# EAGLE design Enclosure 85x58 PBC-AW (EAGLE 9.6.1)
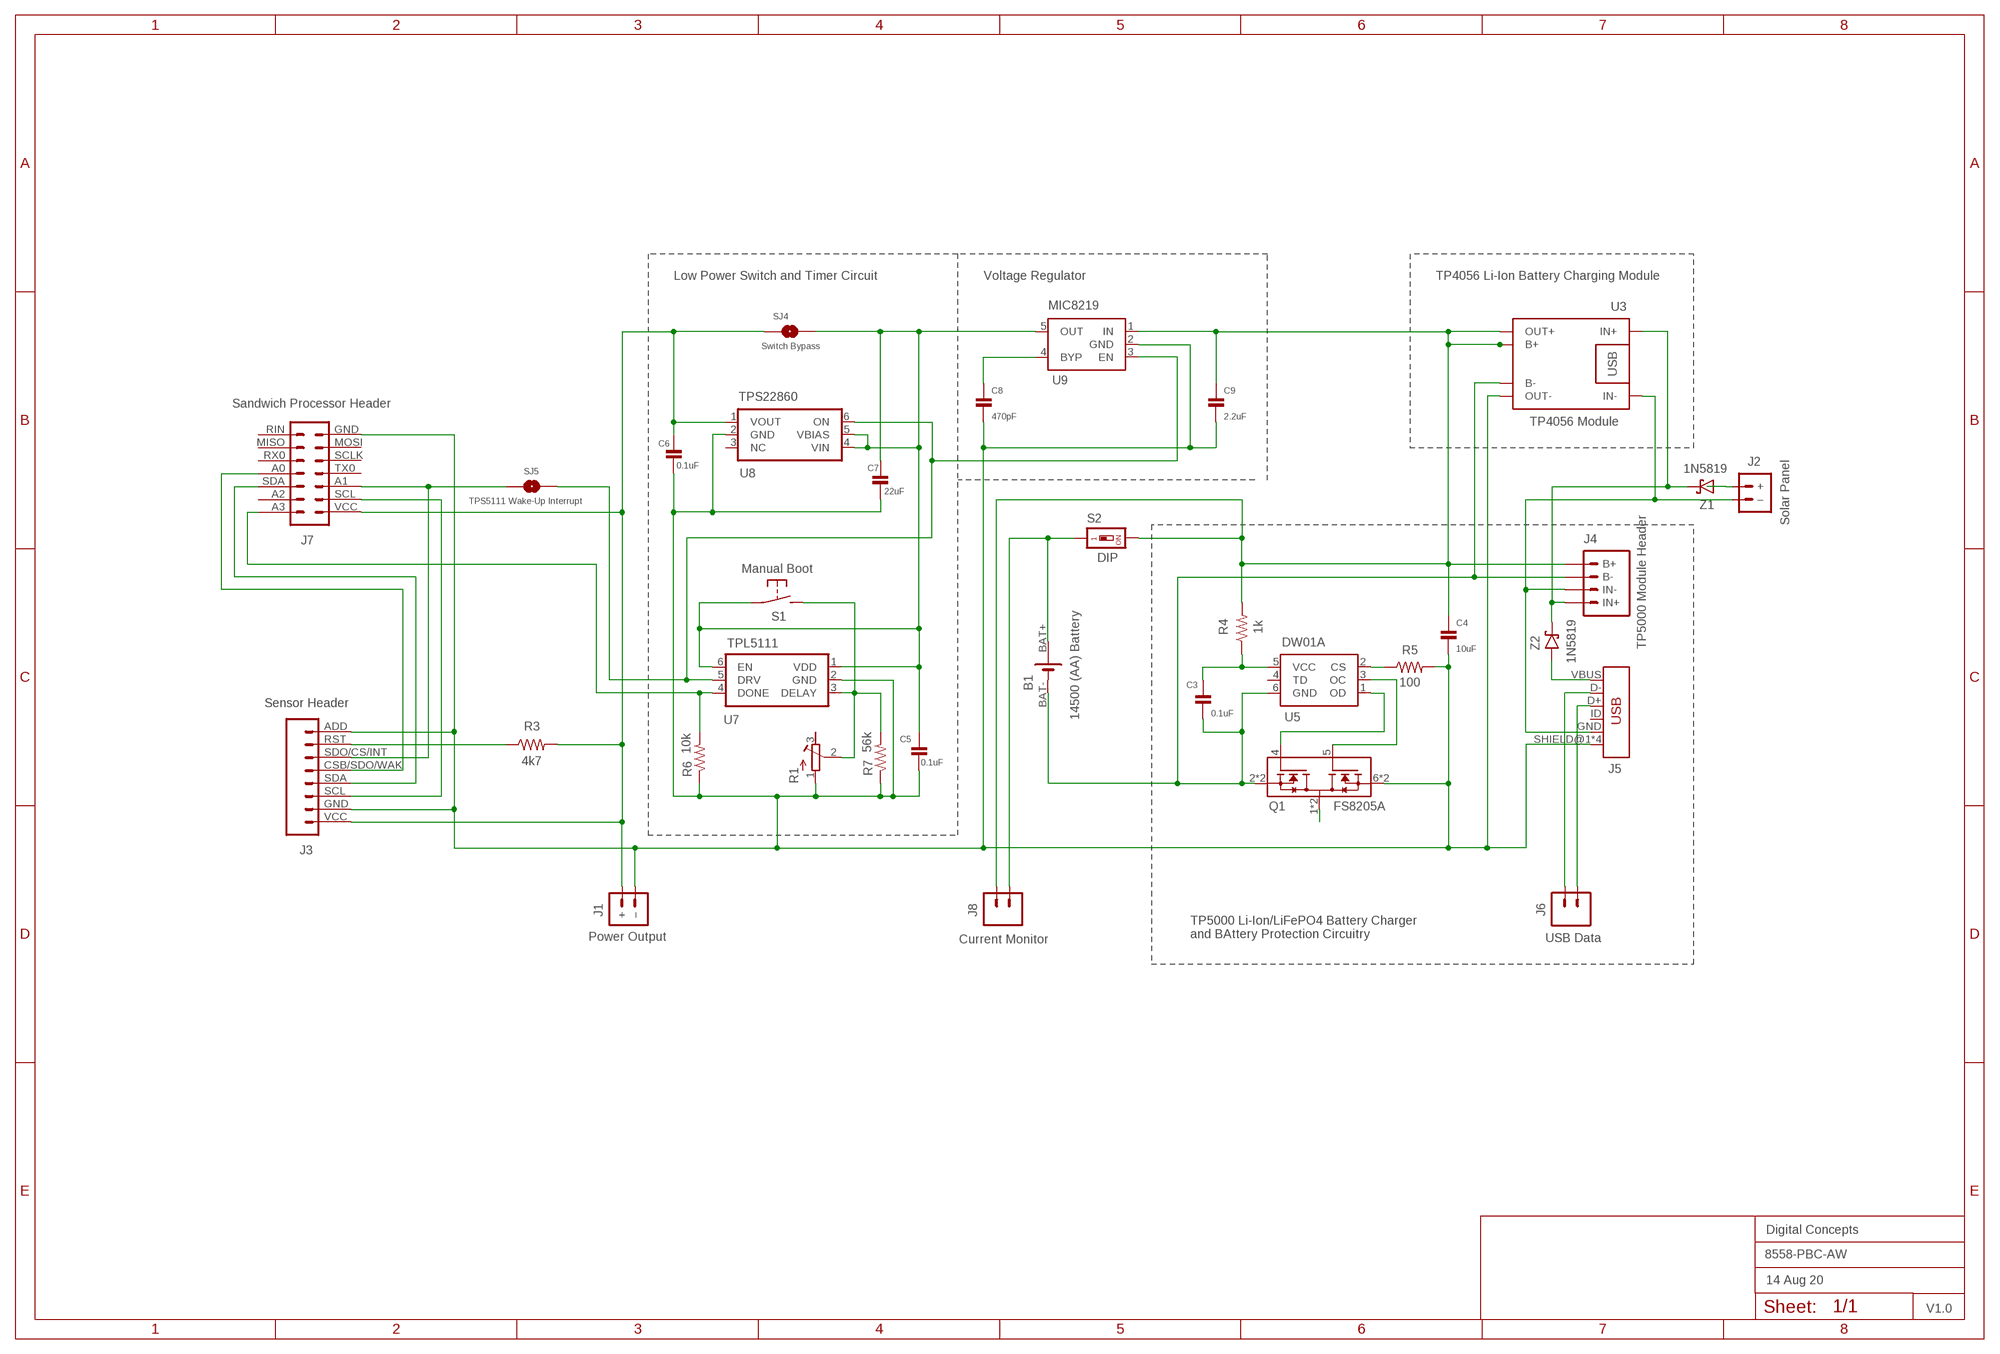
[diagram p0: schematic, sheet 1]
FRAME2 (A3L-LOC): DATE: 14 Aug 20; OWNER: Digital Concepts; TITLE: 8558-PBC-AW; VERSION: V1.0

## Parts
B1  14500 (AA) Battery  BATTERY-HOLDER-14500(AA)  [BATTERY-14500]
C3  0.1uF  CAPACITOR  [C0805]
C4  10uF  CAPACITOR  [C0805]
C5  0.1uF  CAPACITOR  [C0805]
C6  0.1uF  CAPACITOR  [C0805]
C7  22uF  CAPACITOR  [C0805]
C8  470pF  CAPACITOR  [C0805]
C9  2.2uF  CAPACITOR  [C0805]
J1  Power Output  JST-PH1.25-MALE  [JST-PH1.25]
J2  Solar Panel  JST-PH2.0-MALE  [JST-PH2.0]
J3  Sensor Header  HEADER-1X8-SENSOR  [CONN_08-SENSOR]
J4  TP5000 Module Header  TP5000-MODULE  [CONN_04-GENERIC]
J5  USB  USB_MINI-B_SMT  [USB-MINIB]
J6  USB Data  1X2-PIN-HEADER  [CONN_02-GENERIC]
J7  Sandwich Processor Header  HEADER-2X7-SANDWICH-PROCESSOR  [CONN_2X7-WIJNAND-PROCESSOR]
J8  JST-PH2.0-MALE-HORIZONTALJST-PTH-2  [JST-2-PTH]
Q1  FS8205A  [SOP65P640X120-8N]
R1  RESISTOR-TRIMM64W  [RTRIM64W]
R3  4k7  RESISTORR0805  [R0805]
R4  1k  RESISTORR0805  [R0805]
R5  100  RESISTORR0805  [R0805]
R6  10k  RESISTORR0805  [R0805]
R7  56k  RESISTORR0805  [R0805]
S1  Manual Boot  MOMENTARY-SWITCH-2-PIN  [SWITCH-2-PAD]
S2  DIP  SWITCH-DIP-SWS001  [SMS-001]
SJ4  Switch Bypass  SJ  [SJ]
SJ5  TPS5111 Wake-Up Interrupt  SJ  [SJ]
U3  TP4056 Module  BATTERY-CHARGER-LI-PROT  [BATTERY-CHARGER-LI-PROT]
U5  DW01A  [SOT23-6]
U7  TPL5111  TPL5111DDCR  [SOT-23-6]
U8  TPS22860  [SOT-23-6]
U9  MIC8219  MIC5219XX  [SOT-23-5]
Z1  1N5819  1N5819-SOD-123  [SOD-123]
Z2  1N5819  1N5819-SOD-123  [SOD-123]

## Nets
GND: C4.2 C5.2 C6.2 C7.2 C8.2 C9.2 J1.-(–) J3.ADD J3.GND J5.SHIELD@1(SHIELD) J5.SHIELD@2(SHIELD) J5.SHIELD@3(SHIELD) J5.SHIELD@4(SHIELD) J7.GND Q1.6(S2) Q1.7(S2) R1.1(A) R5.2 R6.1 R7.1 U3.OUT- U7.2(GND) U8.2(GND) U9.2(GND)
N$1: J2.+ Z1.A
N$2: J2.-(–) J4.2(IN-) J5.GND U3.IN-
N$3: R5.1 U5.2(CS)
N$4: Q1.1(D12) Q1.8(D12)
N$5: J4.1(IN+) U3.IN+ Z1.C Z2.C
N$6: C4.1 C9.1 J4.4(B+) J8.1 R4.2 S2.2 U3.B+ U3.OUT+ U9.1(IN)
N$7: C8.1 U9.4(BYP)
N$8: J3.SCL J7.SCL
N$9: J3.RST R3.1
N$10: J3.CSB/SDO/WAK J7.A0
N$11: J3.SDA J7.SDA
N$12: B1.BAT+ J8.2 S2.1
N$18: Q1.5(G2) U5.3(OC)
N$19: J5.VBUS Z2.A
N$20: Q1.4(G1) U5.1(OD)
N$21: J5.D+ J6.2
N$22: C3.1 R4.1 U5.5(VCC)
N$23: B1.BAT- C3.2 J4.3(B-) Q1.2(S1) Q1.3(S1) U3.B- U5.6(GND)
N$24: J5.D- J6.1
N$25: R1.2(S) R7.2 S1.P$2(S) U7.3(DELAY)
N$26: C5.1 C7.1 S1.P$1(P) SJ4.2 U7.1(VDD) U7.6(EN) U8.4(VIN) U8.5(VBIAS) U9.5(OUT)
N$28: SJ5.2 U7.5(DRV) U8.6(ON) U9.3(EN)
N$29: J7.A3 R6.2 U7.4(DONE)
N$30: J3.SDO/CS/INT J7.A1 SJ5.1
VCC: C6.1 J1.+ J3.VCC J7.VCC R3.2 SJ4.1 U8.1(VOUT)
Unconnected: J5.ID J7.A2 J7.MISO J7.MOSI J7.RIN J7.RX0 J7.SCLK J7.TX0 R1.3(E) U5.4(TD) U8.3(NC)

## Notes on the sheet
- Low Power Switch and Timer Circuit | Voltage Regulator | TP4056 Li-Ion Battery Charging Module
- TP5000 Li-Ion/LiFePO4 Battery Charger
  and BAttery Protection Circuitry
- Current Monitor

## Library data of the parts
B1 = digitalconcepts:BATTERY-HOLDER-14500(AA): 14500 (AA) battery holder
C3-C9 = digitalconcepts:CAPACITOR: 0805 Capacitor
J1 = digitalconcepts:JST-PH1.25-MALE: PH1.25 Male PCB Connector
J2 = digitalconcepts:JST-PH2.0-MALE: PH2.0 Male PCB Connector
J3 = digitalconcepts:HEADER-1X8-SENSOR: IoT Sensors 1x8 Pin Header for 'Sandwich' IoT Sensors
J4 = digitalconcepts:TP5000-MODULE: TP5000 Module Pin Header
J5 = digitalconcepts:USB_MINI-B: USB Mini-B Connector Breaks out 5 pins, and includes shield pins if needed.
J6 = digitalconcepts:1X2-PIN-HEADER: Single Row 2-Pin Header
J7 = digitalconcepts:HEADER-2X7-SANDWICH-PROCESSOR: 'Sandwixh' Processor 2x7 Pin Header for 'Sandwich' Processor/RFM95W PCBs
J8 = digitalconcepts:JST-PH2.0-MALE-HORIZONTAL: Multi connection point. Often used as Generic Header-pin footprint for 0.1 inch spaced/style header connections On any of the 0.1 inch spaced packages, you can populate with these: Break Away Headers - Straight <https://www.sparkfun.com/products/116> (PRT-00116) Break Away Male Headers - Right Angle <https://www.sparkfun.com/products/553> (PRT-00553) Female Headers <https://www.sparkfun.com/products/115> (PRT-00115) Break Away Headers - Machine Pin <https://www.sparkfun.com/products/117> (PRT-00117) Break Away Female Headers - Swiss Machine Pin <https://www.sparkfun.com/products/743> (PRT-00743) For SCREWTERMINALS and SPRING TERMINALS visit here: Screw Terimnals on SparkFun.com <https://www.sparkfun.com/search/results?term=Screw+Terminals> (5mm/3.5mm/2.54mm spacing) This device is also useful as a general connection point to wire up your design to another part of your project. Our various solder wires solder well into these plated through hole pads. Hook-Up Wire - Assortment (Stranded, 22 AWG) <https://www.sparkfun.com/products/11375> (PRT-11375) Hook-Up Wire - Assortment (Solid Core, 22 AWG) <https://www.sparkfun.com/products/11367> (PRT-11367) View the entire wire category on our website here <https://www.sparkfun.com/categories/141> Special notes: Molex polarized connector foot print use with: PRT-08233 with associated crimp pins and housings. 2.54_SCREWTERM for use with PRT-10571. 3.5mm Screw Terminal footprints for PRT-08084 5mm Screw Terminal footprints for use with PRT-08432; PROD_ID: CONN-09863; SKU: PRT-09914
Q1 = FS8205A:FS8205A: N/A; AVAILABILITY: Unavailable; MF: Fortune Semiconductor; MP: FS8205A; PACKAGE: Package; PRICE: None
R1 = digitalconcepts:RESISTOR-TRIMM: Trimm resistor
R3-R7 = digitalconcepts:RESISTOR: RESISTOR, American symbol; SPICEPREFIX: R
S1 = digitalconcepts:MOMENTARY-SWITCH-2-PIN: 2 Pin Momentary Switch
S2 = digitalconcepts:SWITCH-DIP-SWS001: SMD Dip Switch 1 pol.
SJ4 SJ5 = digitalconcepts:SJ: Solder Jumper
U3 = digitalconcepts:BATTERY-CHARGER-LI-PROT: TP4056 Li Battery Charger module with PCB (rather than module) footprint
U5 = DW01A:DW01A; AVAILABILITY: Unavailable; DESCRIPTION: One Cell Lithium-ion/Polymer Battery Protection IC; MF: Fortune Semiconductor; MP: DW01A; PACKAGE: SOT-23-6 Fortune Semiconductor; PRICE: None
U7 = TPL5111DDCR:TPL5111DDCR: TPL5111 Nano-Power System Timer
U8 = TPL5111DDCR:TPS22860: Texas Instruments TPS22860 Ultra-Low Leakage Load Switch
U9 = digitalconcepts:MIC5219XX: VOLTAGE REGULATOR; OC_FARNELL: unknown; OC_NEWARK: unknown
Z1 Z2 = digitalconcepts:1N5819-SOD-123: 1N5819 Schottky Diode SOD-123

## Board
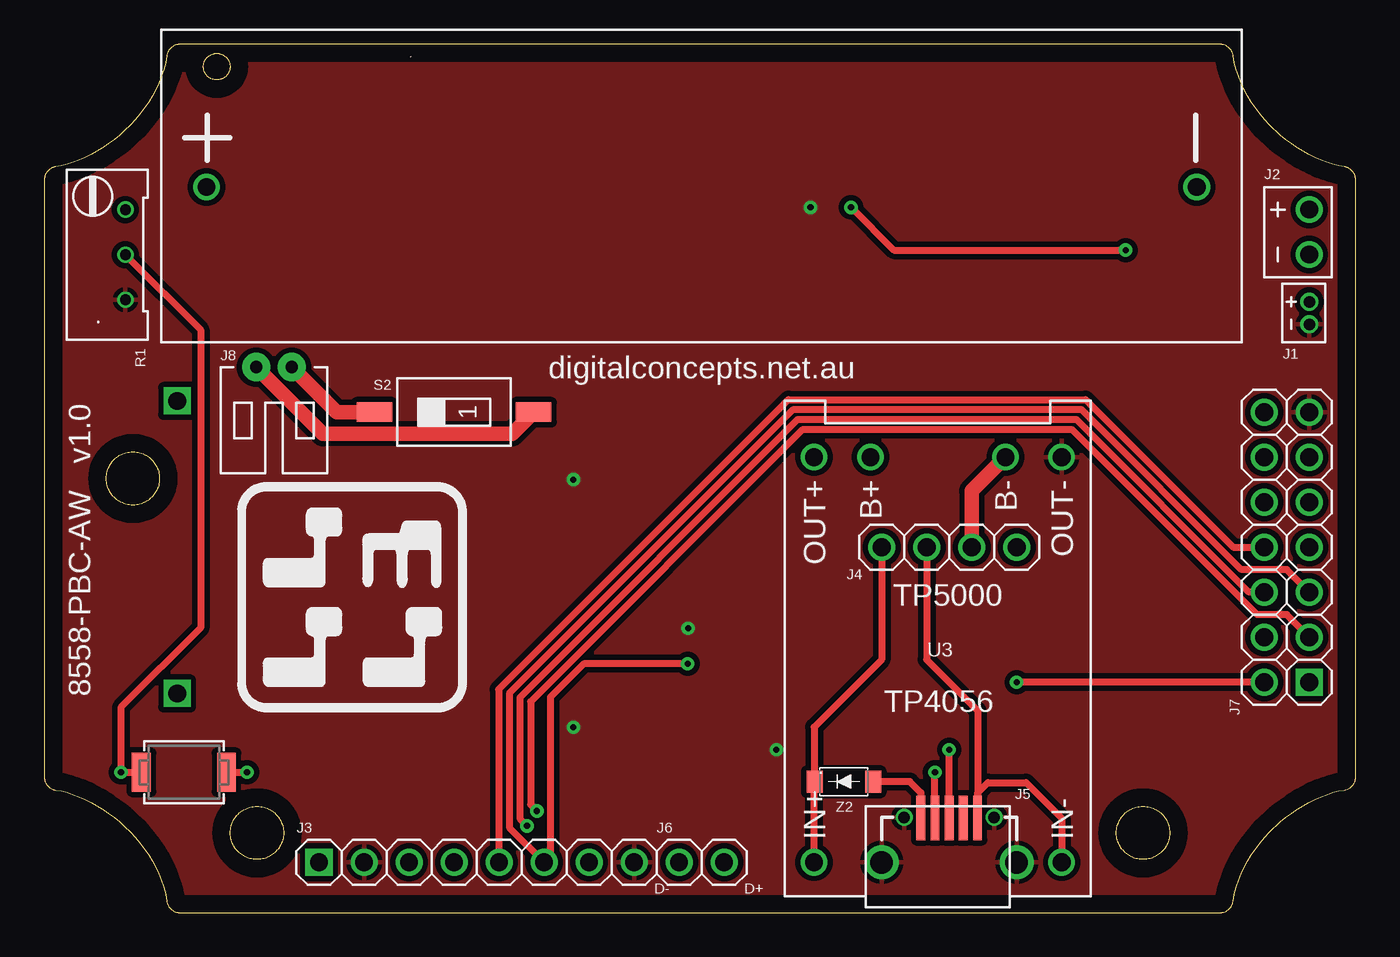
[diagram p1: board, top side]
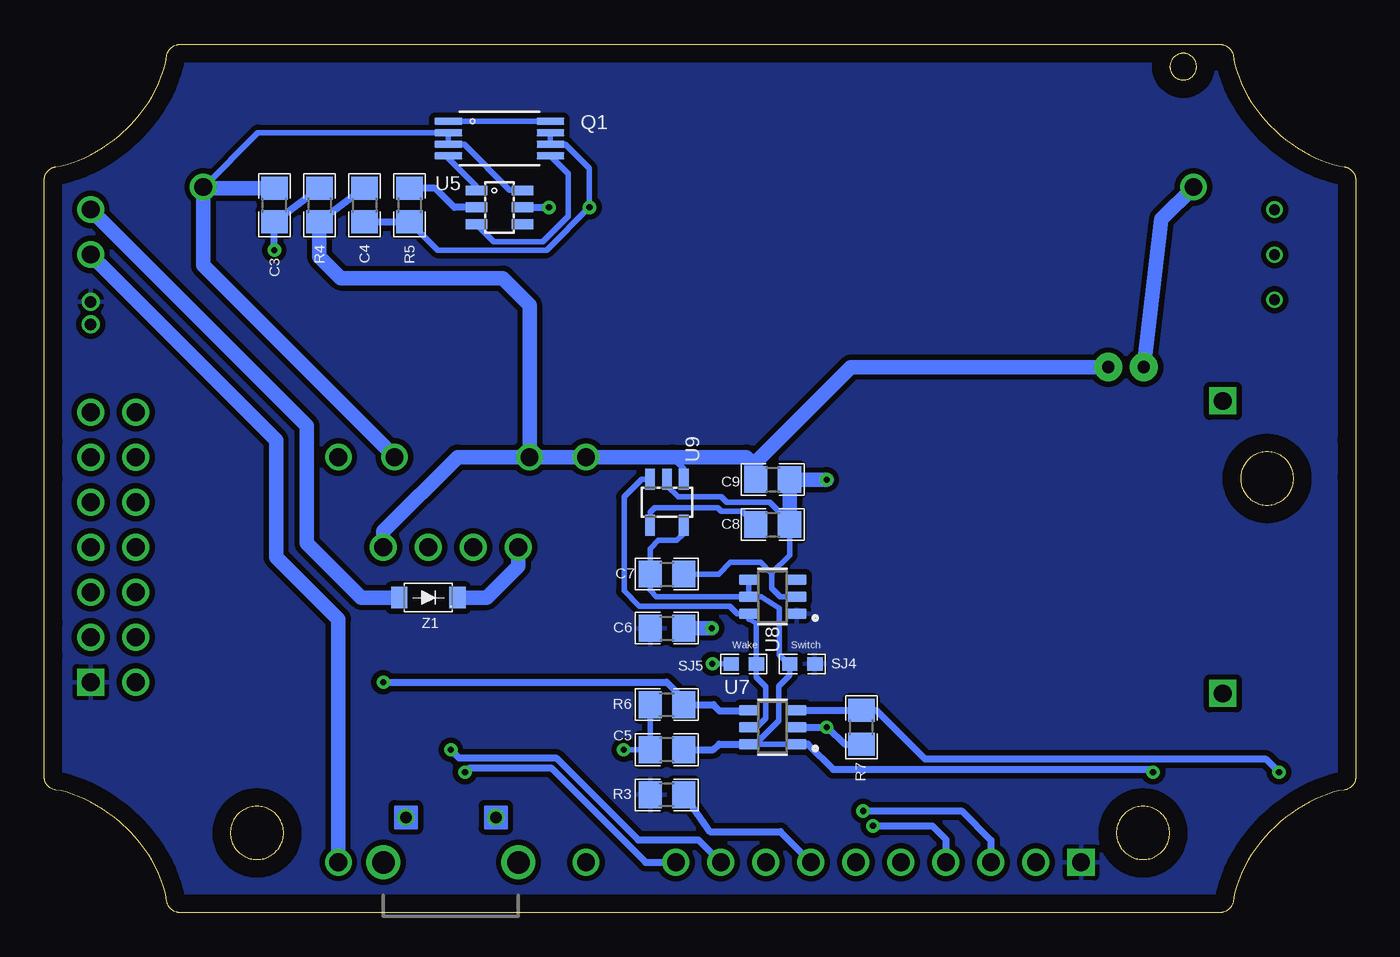
[diagram p2: board, bottom side, seen from below]

Size 74 x 49 mm. Coordinates in mm from the lower left corner, seen from the top.
Outline: 7.52,48.99 7.48,48.98 7.43,48.97 7.39,48.95 7.35,48.94 7.31,48.92 7.27,48.89 7.24,48.87 7.2,48.85 7.17,48.82 7.13,48.79 7.1,48.76 7.08,48.73 7.05,48.69 7.02,48.66 7,48.62 6.98,48.58 6.96,48.54 6.95,48.5 6.93,48.46 6.92,48.41 6.92,48.37 6.85,47.96 6.75,47.57 6.61,47.18 6.47,46.8 6.29,46.43 6.09,46.08 5.88,45.72 5.65,45.38 5.39,45.06 5.13,44.74 4.85,44.44 4.55,44.16 4.26,43.88 3.94,43.62 3.62,43.39 3.3,43.16 2.96,42.95 2.63,42.78 2.29,42.6 1.96,42.45 1.62,42.33 1.29,42.22 0.96,42.13 0.64,42.09 0.59,42.08 0.55,42.07 0.51,42.05 0.47,42.04 0.43,42.02 0.39,42 0.35,41.98 0.31,41.96 0.28,41.93 0.25,41.9 0.22,41.87 0.16,41.81 0.13,41.77 0.11,41.73 0.09,41.7 0.07,41.66 0.05,41.61 0.03,41.57 0.02,41.53 0.01,41.48 0,41.44 0,41.39 0,41.34 0,41.33 0,26.66 0,24.57 0,7.61 0,7.56 0.01,7.52 0.02,7.47 0.03,7.43 0.05,7.39 0.07,7.34 0.09,7.31 0.11,7.27 0.13,7.23 0.16,7.19 0.19,7.16 0.22,7.13 0.25,7.1 0.28,7.07 0.31,7.04 0.35,7.02 0.43,6.98 0.47,6.96 0.51,6.95 0.55,6.93 0.59,6.92 0.64,6.91 0.96,6.87 1.29,6.78 1.62,6.67 1.96,6.55 2.29,6.4 2.63,6.22 2.96,6.05 3.3,5.84 3.62,5.61 3.94,5.38 4.26,5.12 4.55,4.84 4.85,4.56 5.13,4.26 5.39,3.94 5.65,3.62 5.88,3.28 6.09,2.92 6.29,2.57 6.47,2.2 6.61,1.82 6.75,1.43 6.85,1.04 6.92,0.63 6.92,0.59 6.93,0.54 6.95,0.5 6.96,0.46 6.98,0.42 7,0.38 7.02,0.34 7.05,0.31 7.08,0.28 7.1,0.24 7.13,0.21 7.17,0.18 7.2,0.15 7.24,0.13 7.27,0.11 7.31,0.08 7.35,0.06 7.39,0.05 7.43,0.03 7.48,0.02 7.52,0.01 7.56,0 7.61,0 66.39,0 66.43,0 66.48,0.01 66.52,0.02 66.57,0.03 66.65,0.06 66.69,0.08 66.73,0.11 66.76,0.13 66.8,0.15 66.87,0.21 66.9,0.24 66.92,0.28 66.95,0.31 66.98,0.34 67.02,0.42 67.04,0.46 67.05,0.5 67.07,0.54 67.08,0.59 67.08,0.63 67.14,1.04 67.25,1.43 67.39,1.82 67.53,2.2 67.71,2.57 67.91,2.92 68.12,3.28 68.35,3.62 68.61,3.94 68.87,4.26 69.15,4.56 69.74,5.12 70.06,5.38 70.38,5.61 70.7,5.84 71.03,6.05 71.37,6.22 71.71,6.4 72.04,6.55 72.38,6.67 72.71,6.78 73.04,6.87 73.36,6.91 73.41,6.92 73.45,6.93 73.53,6.96 73.57,6.98 73.65,7.02 73.68,7.04 73.72,7.07 73.75,7.1 73.78,7.13 73.81,7.16 73.84,7.19 73.87,7.23 73.89,7.27 73.91,7.31 73.93,7.34 73.95,7.39 73.97,7.43 73.98,7.47 73.99,7.52 73.99,7.56 74,7.61 74,14.51 74,16.35 74,24.49 74,26.59 74,41.39 74,41.44 73.99,41.48 73.98,41.53 73.97,41.57 73.95,41.61 73.93,41.66 73.91,41.7 73.89,41.73 73.87,41.77 73.84,41.81 73.81,41.84 73.78,41.87 73.75,41.9 73.72,41.93 73.69,41.96 73.65,41.98 73.61,42 73.57,42.02 73.53,42.04 73.49,42.05 73.45,42.07 73.41,42.08 73.36,42.09 73.04,42.13 72.71,42.22 72.38,42.33 72.04,42.45 71.71,42.6 71.37,42.78 71.04,42.95 70.7,43.16 70.38,43.39 70.06,43.62 69.74,43.88 69.15,44.44 68.87,44.74 68.61,45.06 68.35,45.38 68.12,45.72 67.91,46.08 67.71,46.43 67.53,46.8 67.39,47.18 67.25,47.57 67.15,47.96 67.08,48.37 67.08,48.41 67.07,48.46 67.05,48.5 67.04,48.54 67.02,48.58 67,48.62 66.98,48.66 66.95,48.69 66.92,48.73 66.9,48.76 66.87,48.79 66.8,48.85 66.76,48.87 66.73,48.89 66.69,48.92 66.65,48.94 66.57,48.97 66.52,48.98 66.48,48.99 66.44,49 66.39,49 7.61,49 7.56,49 7.52,48.99
Outline: 62.3,5.97 62.4,5.95 62.49,5.92 62.58,5.88 62.67,5.84 62.76,5.8 62.84,5.74 62.92,5.69 62.99,5.63 63.13,5.49 63.19,5.42 63.24,5.34 63.3,5.26 63.34,5.17 63.38,5.08 63.42,4.99 63.45,4.9 63.47,4.8 63.49,4.71 63.5,4.6 63.5,4.4 63.49,4.3 63.47,4.2 63.45,4.1 63.42,4.01 63.38,3.92 63.34,3.83 63.3,3.74 63.24,3.66 63.19,3.58 63.13,3.51 62.99,3.37 62.92,3.31 62.84,3.26 62.76,3.2 62.67,3.16 62.58,3.12 62.49,3.08 62.4,3.05 62.3,3.03 62.2,3.01 62.1,3 61.9,3 61.8,3.01 61.7,3.03 61.6,3.05 61.51,3.08 61.42,3.12 61.33,3.16 61.24,3.2 61.08,3.31 61.01,3.37 60.87,3.51 60.81,3.58 60.76,3.66 60.7,3.74 60.66,3.83 60.62,3.92 60.58,4.01 60.55,4.1 60.53,4.2 60.51,4.3 60.5,4.4 60.5,4.6 60.51,4.71 60.53,4.8 60.55,4.9 60.58,4.99 60.62,5.08 60.66,5.17 60.7,5.26 60.76,5.34 60.81,5.42 60.87,5.49 61.01,5.63 61.08,5.69 61.16,5.74 61.24,5.8 61.33,5.84 61.42,5.88 61.51,5.92 61.6,5.95 61.7,5.97 61.8,5.99 61.9,6 62.1,6 62.2,5.99 62.3,5.97
Outline: 12.3,5.97 12.4,5.95 12.49,5.92 12.58,5.88 12.67,5.84 12.76,5.8 12.84,5.74 12.92,5.69 12.99,5.63 13.06,5.56 13.13,5.49 13.19,5.42 13.24,5.34 13.3,5.26 13.34,5.17 13.38,5.08 13.42,4.99 13.45,4.9 13.47,4.8 13.49,4.71 13.5,4.6 13.5,4.4 13.49,4.3 13.47,4.2 13.45,4.1 13.42,4.01 13.38,3.92 13.34,3.83 13.3,3.74 13.24,3.66 13.19,3.58 13.13,3.51 13.06,3.44 12.99,3.37 12.92,3.31 12.84,3.26 12.76,3.2 12.67,3.16 12.58,3.12 12.49,3.08 12.4,3.05 12.3,3.03 12.2,3.01 12.1,3 11.9,3 11.8,3.01 11.7,3.03 11.6,3.05 11.51,3.08 11.33,3.16 11.24,3.2 11.08,3.31 11.01,3.37 10.94,3.44 10.87,3.51 10.81,3.58 10.76,3.66 10.7,3.74 10.66,3.83 10.62,3.92 10.58,4.01 10.55,4.1 10.53,4.2 10.51,4.3 10.5,4.4 10.5,4.6 10.51,4.71 10.53,4.8 10.55,4.9 10.58,4.99 10.62,5.08 10.66,5.17 10.7,5.26 10.76,5.34 10.81,5.42 10.87,5.49 10.94,5.56 11.01,5.63 11.08,5.69 11.16,5.74 11.24,5.8 11.33,5.84 11.51,5.92 11.6,5.95 11.7,5.97 11.8,5.99 11.9,6 12.1,6 12.2,5.99 12.3,5.97
Outline: 5.3,25.97 5.4,25.95 5.49,25.92 5.58,25.88 5.67,25.84 5.76,25.8 5.84,25.74 5.92,25.69 5.99,25.63 6.13,25.49 6.19,25.42 6.24,25.34 6.3,25.26 6.34,25.17 6.38,25.08 6.42,24.99 6.45,24.9 6.47,24.8 6.49,24.7 6.5,24.6 6.5,24.4 6.49,24.3 6.47,24.2 6.45,24.1 6.42,24.01 6.38,23.92 6.34,23.83 6.3,23.74 6.24,23.66 6.19,23.58 6.13,23.51 6.06,23.44 5.99,23.37 5.92,23.31 5.84,23.26 5.76,23.2 5.67,23.16 5.58,23.12 5.49,23.08 5.4,23.05 5.3,23.03 5.2,23.01 5.1,23 4.9,23 4.79,23.01 4.7,23.03 4.6,23.05 4.51,23.08 4.42,23.12 4.33,23.16 4.24,23.2 4.16,23.26 4.08,23.31 4.01,23.37 3.94,23.44 3.87,23.51 3.81,23.58 3.76,23.66 3.7,23.74 3.66,23.83 3.62,23.92 3.58,24.01 3.55,24.1 3.53,24.2 3.51,24.3 3.5,24.4 3.5,24.6 3.51,24.7 3.53,24.8 3.55,24.9 3.58,24.99 3.62,25.08 3.66,25.17 3.7,25.26 3.76,25.34 3.81,25.42 3.87,25.49 4.01,25.63 4.08,25.69 4.16,25.74 4.24,25.8 4.33,25.84 4.42,25.88 4.51,25.92 4.6,25.95 4.7,25.97 4.79,25.99 4.9,26 5.1,26 5.2,25.99 5.3,25.97
Outline: 9.88,48.47 9.93,48.46 9.98,48.45 10.02,48.43 10.07,48.41 10.11,48.39 10.15,48.36 10.19,48.33 10.23,48.3 10.26,48.27 10.29,48.24 10.32,48.2 10.35,48.16 10.38,48.12 10.4,48.08 10.42,48.03 10.44,47.99 10.45,47.94 10.46,47.89 10.47,47.84 10.48,47.79 10.48,47.69 10.47,47.64 10.46,47.59 10.45,47.54 10.44,47.49 10.42,47.45 10.4,47.4 10.38,47.36 10.35,47.32 10.32,47.28 10.29,47.24 10.26,47.21 10.23,47.18 10.19,47.14 10.15,47.12 10.11,47.09 10.07,47.07 10.02,47.05 9.98,47.03 9.93,47.01 9.88,47 9.83,46.99 9.78,46.99 9.68,46.99 9.63,46.99 9.58,47 9.53,47.01 9.48,47.03 9.39,47.07 9.35,47.09 9.31,47.12 9.27,47.14 9.23,47.18 9.2,47.21 9.17,47.24 9.13,47.28 9.11,47.32 9.08,47.36 9.06,47.4 9.04,47.45 9.02,47.49 9.01,47.54 9,47.59 8.99,47.64 8.98,47.69 8.98,47.79 8.99,47.84 9,47.89 9.01,47.94 9.02,47.99 9.04,48.03 9.06,48.08 9.08,48.12 9.11,48.16 9.13,48.2 9.17,48.24 9.2,48.27 9.23,48.3 9.27,48.33 9.31,48.36 9.35,48.39 9.39,48.41 9.44,48.43 9.48,48.45 9.53,48.46 9.58,48.47 9.63,48.48 9.68,48.49 9.78,48.49 9.83,48.48 9.88,48.47
Copper layers (1*16): Top 0.035mm / dielectric 1.5mm / Bottom 0.035mm
Design rules "default *": minimum track width 6mil, minimum drill 0.35mm, track to track 6mil, track to pad 6mil, pad to pad 6mil, via to via 6mil, smd to smd 6mil, copper to edge 40mil, drill to drill 6mil, minimum pad ring 1mil, minimum via ring 8mil, stop-mask expansion 4mil, vias tented up to drill 0mil, thermal gap 10mil

### Footprints (pad centres in the part's own frame; a part is rotated, then mirrored left to right if it is on the bottom)
BATTERY-14500 = drill 1: BAT+ -27.94,0; BAT- 27.94,0
C0805 = smd 1.3 x 1.5: 1 -0.95,0; 2 0.95,0
JST-PH1.25 = drill 0.65 pad 1.016: + -0.635,0; - 0.635,0
JST-PH2.0 = drill 1: + -1.27,0; - 1.27,0
CONN_08-SENSOR = drill 1 pad 1.524: ADD 17.78,0; CSB/SDO/WAK 10.16,0; GND 2.54,0; RST 15.24,0; SCL 5.08,0; SDA 7.62,0; SDO/CS/INT 12.7,0 | drill 1 pad 1.524 square: VCC 0,0
CONN_04-GENERIC = drill 1 pad 1.524: 1 0,0; 2 2.54,0; 3 5.08,0; 4 7.62,0
USB-MINIB = smd 2.5 x 0.5: D+ 2.5,0; D- 2.5,0.8; GND 2.5,-1.6; ID 2.5,-0.8; VBUS 2.5,1.6 | drill 1.27: SHIELD@1 0,3.81; SHIELD@2 0,-3.81 | drill 0.65 pad 0.762: SHIELD@3 2.54,2.54; SHIELD@4 2.54,-2.54
CONN_02-GENERIC = drill 1 pad 1.524: 1 0,0; 2 2.54,0
CONN_2X7-WIJNAND-PROCESSOR = drill 1 pad 1.524: A0 7.62,2.54; A1 5.08,0; A2 2.54,2.54; A3 0,2.54; GND 15.24,0; MISO 12.7,2.54; MOSI 12.7,0; RIN 15.24,2.54; RX0 10.16,2.54; SCL 2.54,0; SCLK 10.16,0; SDA 5.08,2.54; TX0 7.62,0 | drill 1 pad 1.524 square: GND@TL -0.635,63.881; GND@TR 15.875,63.881; VCC 0,0
JST-2-PTH = drill 0.7 pad 1.6: 1 -1,0; 2 1,0
SOP65P640X120-8N = smd 1.56 x 0.4: 1 -2.88,0.975; 2 -2.88,0.325; 3 -2.88,-0.325; 4 -2.88,-0.975; 5 2.88,-0.975; 6 2.88,-0.325; 7 2.88,0.325; 8 2.88,0.975
RTRIM64W = drill 0.61: 1 1.27,-2.54; 2 1.27,0; 3 1.27,2.54
R0805 = smd 1.3 x 1.5: 1 -0.95,0; 2 0.95,0
SWITCH-2-PAD = smd 1.067 x 2.184: P$1 -2.4,0; P$2 2.4,0
SMS-001 = smd 1.092 x 2.007: 1 0,-4.496; 2 0,4.496
SJ = smd 0.864 x 0.762: 1 -0.711,0; 2 0.711,0
BATTERY-CHARGER-LI-PROT = drill 1: B+ 10.795,3.81; B- 10.795,-3.81; IN+ -12.065,6.985; IN- -12.065,-6.985; OUT+ 10.795,6.985; OUT- 10.795,-6.985
SOT23-6 = smd 0.55 x 1.2: 1 -0.95,-1.3; 2 0,-1.3; 3 0.95,-1.3; 4 0.95,1.3; 5 0,1.3; 6 -0.95,1.3
SOT-23-6 = smd 1.1 x 0.6: 1 -1.35,0.95; 2 -1.35,0; 3 -1.35,-0.95; 4 1.35,-0.95; 5 1.35,0; 6 1.35,0.95
SOT-23-5 = smd 0.55 x 1.2: 1 -0.95,-1.3; 2 0,-1.3; 3 0.95,-1.3; 4 0.95,1.3; 5 -0.95,1.3
SOD-123 = smd 0.91 x 1.22: A -1.65,0; C 1.65,0

### Placement (x,y rotation side)
B1  37.09,40.94 0 top
C3  61.02,39.93 90 bottom
C4  55.94,39.93 270 bottom
C5  38.87,9.19 180 bottom
C6  38.87,16.05 0 bottom
C7  38.87,19.1 0 bottom
C8  32.9,21.89 0 bottom
C9  32.9,24.43 0 bottom
J1  71.38,33.83 270 top
J2  71.38,38.4 270 top
J3  15.5,2.84 0 top
J4  47.25,20.62 0 top
J5  51.06,2.84 90 top
J6  38.36,2.84 180 top
J7  71.38,13 90 top
J8  12.96,30.78 180 top
Q1  48.32,43.69 0 bottom
R1  3.31,37.13 0 top
R3  38.87,6.65 180 bottom
R4  58.48,39.93 270 bottom
R5  53.4,39.93 270 bottom
R6  38.87,11.73 0 bottom
R7  27.9,10.46 90 bottom
S1  7.88,7.92 180 top
S2  23.12,28.24 90 top
SJ4  31.22,14.04 180 bottom
SJ5  34.53,14.04 0 bottom
U3  50.43,14.91 90 top
U5  48.32,39.8 270 bottom
U7  32.9,10.46 180 bottom
U8  32.9,17.83 180 bottom
U9  38.87,23.16 180 bottom
Z1  52.33,17.78 0 bottom
Z2  45.12,7.39 180 top

### Tracks (layer width: path | path; a pad name or v marks a point on that pad's centre or on a via)
GND  (via drill 0.35)
  Bottom 0.305: R6.1 C5.2 v41.31,9.19 | R5.2 51.81,37.39 45.65,37.39 v43.24,39.8 43.24,42 44.6,43.36 Q1.6 Q1.7 | v29.85,10.46 29.83,10.48 v29.85,10.46 29.81,10.46 | U8.2 32.47,17.83 32.95,18.31 32.95,19.12 32.98,19.15 | 32.98,19.15 33.59,19.76 35.29,19.76 35.95,19.1 C7.2 | 32.98,19.15 31.95,20.18 C8.2 31.95,22.03 33.08,23.16 35.49,23.16 35.8,23.47 38.23,23.47 38.87,24.1 U9.2
  Bottom 0.406: C4.2 R5.2 | U7.2 v29.85,10.46 | 29.81,10.46 28.84,9.51 R7.1
  Bottom 0.813: C8.2 C9.2 v29.85,24.43 | v36.33,16.05 C6.2
  pour Top (isolate 0.305): -1.44,50.36 -1.44,-1.54 75.56,-1.54 75.56,50.36
N$1
  Bottom 0.813: J2.+ 59.18,27.47 59.18,20.84 56.11,17.78 Z1.A
N$2
  Top 0.406: J4.2 49.79,14.27 52.66,11.4 J5.GND 52.66,6.75 53.25,7.34 55.4,7.34 57.41,5.33 U3.IN-
  Bottom 0.813: U3.IN- 57.41,16.56 60.92,20.06 60.92,26.67 J2.-
N$3
  Bottom 0.406: U5.2 50.86,39.8 51.94,40.88 R5.1
N$4
  Bottom 0.305: Q1.8 Q1.1
N$5
  Top 0.305: 43.44,7.36 Z2.C
  Top 0.406: U3.IN+ 43.44,7.36 | Z2.C 43.44,7.41 43.44,10.46 47.25,14.27 J4.1
  Bottom 0.813: J4.1 47.25,19.56 49.03,17.78 Z1.C
N$6
  Top 0.813: S2.2 16.5,28.24 J8.1
  Bottom 0.305: U9.1 37.92,25.06 38.56,25.7
  Bottom 0.406: C4.1 R4.2
  Bottom 0.813: U3.B+ U3.OUT+ 38.56,25.7 34.38,25.7 33.85,25.17 C9.1 33.85,25.41 28.48,30.78 J8.1 | U3.B+ 46.62,34.29 48.13,35.8 57.26,35.8 58.48,37.02 R4.2 | U3.B+ 50.68,25.7 54.87,21.51 J4.4
N$7
  Bottom 0.305: C8.1 34.61,22.65 35.81,22.65 36.01,22.86 39.55,22.86 39.82,22.59 U9.4
N$8  (via drill 0.35)
  Top 0.406: v27.79,5.74 27.44,6.09 27.44,11.91 42.81,27.28 57.97,27.28 68.43,16.81 70.11,16.81 J7.SCL
  Bottom 0.406: v27.79,5.74 22.23,5.74 20.58,4.09 J3.SCL
N$9
  Bottom 0.406: J3.RST 32.47,4.57 36.45,4.57 R3.1
N$10
  Top 0.406: J3.CSB/SDO/WAK 25.64,2.87 25.64,12.6 41.99,28.95 58.76,28.95 67.09,20.62 J7.A0
N$11  (via drill 0.35)
  Top 0.406: J7.SDA 67.98,18.08 58.22,27.84 42.53,27.84 26.83,12.14 26.83,5.31 v27.24,4.9
  Bottom 0.406: v27.24,4.9 23.88,4.9 23.12,4.14 J3.SDA
N$12
  Top 0.813: S2.1 26.4,27.02 15.72,27.02 J8.2
  Bottom 0.813: B1.BAT+ 10.96,39.13 J8.2
N$18
  Bottom 0.305: Q1.5 44.42,41.69 44.42,39.3 45.86,37.86 48.63,37.86 U5.3
N$19
  Top 0.406: Z2.A 48.85,7.39 49.46,6.78 J5.VBUS
N$20
  Bottom 0.305: Q1.4 51.2,42.56 49.62,40.98 U5.1
N$21  (via drill 0.35)
  Top 0.406: J5.D+ v51.06,9.19
  Bottom 0.406: v51.06,9.19 50.6,8.74 45.12,8.74 40.49,4.11 37.09,4.11 J6.2
N$22  (via drill 0.35)
  Top 0.406: v45.52,39.8 47.94,37.39 v61.02,37.39
  Bottom 0.406: R4.1 C3.1 v61.02,37.39 | U5.5 v45.52,39.8
N$23
  Top 0.813: U3.B- 52.33,23.8 J4.3
  Bottom 0.305: U5.6 47.04,40.77 47.73,40.77 50.31,43.36 Q1.3 Q1.2 61.95,44.01 65.01,40.94 B1.BAT- | U3.B- 54.24,25.73
  Bottom 0.813: 54.24,25.73 65.03,36.52 B1.BAT- 64.96,40.88 C3.2
N$24  (via drill 0.35)
  Top 0.406: J5.D- v50.26,7.92
  Bottom 0.406: v50.26,7.92 50.01,8.18 45.4,8.18 40.06,2.84 J6.1
N$25  (via drill 0.35)
  Top 0.406: S1.P$2 v4.32,7.92 4.32,11.58 8.82,16.08 8.82,32.89 R1.2
  Bottom 0.406: v4.32,7.92 5.09,8.68 24.31,8.68 27.04,11.41 R7.2 U7.3
N$26  (via drill 0.35)
  Top 0.406: S1.P$1 v11.44,7.92
  Bottom 0.305: U8.5 33.55,17.83 32.52,17.17 32.52,14.55 32.01,14.04 SJ4.2 31.93,13.41 32.57,12.77 32.57,10.83 33.86,9.54 U7.6 U7.1 | U8.5 U8.4 | U8.5 39.46,17.83 39.82,18.18 C7.1 39.82,20.54 39.35,21 38.31,21 37.92,21.39 U9.5
  Bottom 0.406: v11.44,7.92 11.6,8.08 29.49,8.08 30.91,9.51 U7.1 | C5.1 36.25,9.19 35.93,9.51 U7.6
N$28
  Bottom 0.305: U7.5 33.76,10.49 33.28,10.97 33.28,12.75 33.81,13.28 SJ5.2 33.81,16.34 34.25,16.56 U8.6 34.91,16.88 35.33,17.3 40.42,17.3 41.28,18.16 41.28,23.46 40.28,24.46 U9.3
N$29  (via drill 0.35)
  Top 0.406: J7.A3 v54.87,13
  Bottom 0.305: U7.4 34.28,11.39 | R6.2 37.92,12.04
  Bottom 0.406: R6.2 36.25,11.73 35.9,11.39 34.28,11.39 | 37.92,12.04 38.88,13 v54.87,13
N$30  (via drill 0.35)
  Top 0.406: J7.A1 70.11,19.35 67.55,19.35 58.5,28.39 42.27,28.39 26.24,12.37 26.24,4.8 J3.SDO/CS/INT 28.45,2.84 28.56,2.94 28.56,12.16 30.44,14.04 v36.3,14.04
  Bottom 0.305: SJ5.1 v36.3,14.04
VCC
  pour Bottom (isolate 0.305): -0.44,49.36 -0.44,-0.54 74.56,-0.54 74.56,49.36

### Text on the board
tPlace: J2 | digitalconcepts.net.au | J1 | 8558-PBC-AW v1.0 | TP5000 | TP4056 | D- | D+
bPlace: Switch | Wake